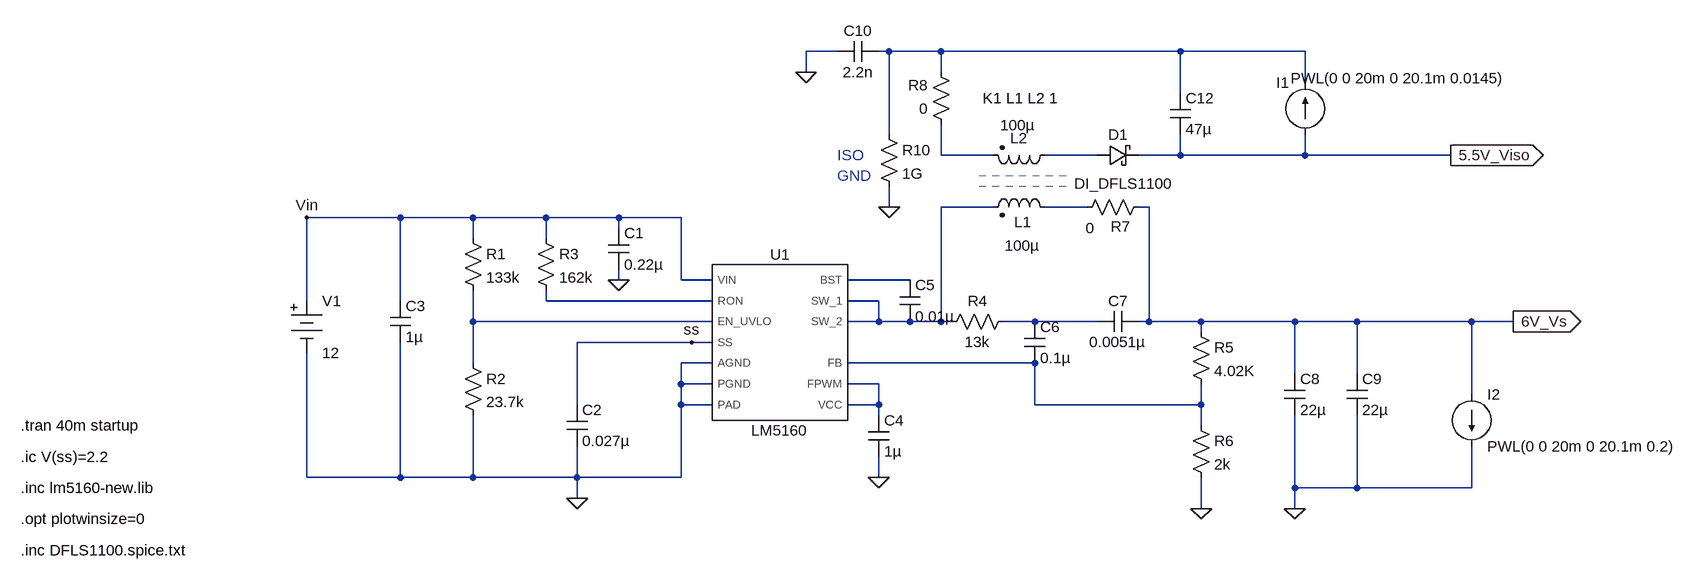
[diagram p0: schematic LM5160_fly-buck.asc]
LM5160_fly-buck.asc, the LTspice schematic file:
Version 4
SHEET 1 1424 680
WIRE 96 -240 48 -240
WIRE 176 -240 160 -240
WIRE 256 -240 176 -240
WIRE 624 -240 256 -240
WIRE 816 -240 624 -240
WIRE 48 -208 48 -240
WIRE 256 -208 256 -240
WIRE 816 -192 816 -240
WIRE 624 -176 624 -240
WIRE 176 -112 176 -240
WIRE 256 -80 256 -128
WIRE 336 -80 256 -80
WIRE 496 -80 416 -80
WIRE 624 -80 624 -112
WIRE 624 -80 560 -80
WIRE 816 -80 816 -112
WIRE 816 -80 624 -80
WIRE 1040 -80 816 -80
WIRE 176 0 176 -32
WIRE 336 0 256 0
WIRE 480 0 416 0
WIRE 576 0 560 0
WIRE -576 16 -720 16
WIRE -464 16 -576 16
WIRE -352 16 -464 16
WIRE -240 16 -352 16
WIRE -144 16 -240 16
WIRE -240 32 -240 16
WIRE -464 48 -464 16
WIRE -352 48 -352 16
WIRE -240 112 -240 96
WIRE -144 112 -144 16
WIRE -96 112 -144 112
WIRE 208 112 112 112
WIRE -720 144 -720 16
WIRE -576 144 -576 16
WIRE -352 144 -352 128
WIRE -96 144 -352 144
WIRE 160 144 112 144
WIRE -464 176 -464 128
WIRE -96 176 -464 176
WIRE 160 176 160 144
WIRE 160 176 112 176
WIRE 208 176 160 176
WIRE 256 176 256 0
WIRE 256 176 208 176
WIRE 272 176 256 176
WIRE 400 176 352 176
WIRE 496 176 400 176
WIRE 576 176 576 0
WIRE 576 176 560 176
WIRE 656 176 576 176
WIRE 800 176 656 176
WIRE 896 176 800 176
WIRE 1072 176 896 176
WIRE 1136 176 1072 176
WIRE 656 192 656 176
WIRE -128 208 -304 208
WIRE -96 208 -128 208
WIRE -464 240 -464 176
WIRE -96 240 -144 240
WIRE 400 240 112 240
WIRE 800 256 800 176
WIRE 896 256 896 176
WIRE -144 272 -144 240
WIRE -96 272 -144 272
WIRE 160 272 112 272
WIRE 1072 288 1072 176
WIRE -304 304 -304 208
WIRE -144 304 -144 272
WIRE -96 304 -144 304
WIRE 160 304 160 272
WIRE 160 304 112 304
WIRE 400 304 400 240
WIRE 656 304 656 272
WIRE 656 304 400 304
WIRE 160 320 160 304
WIRE 656 336 656 304
WIRE -720 416 -720 224
WIRE -576 416 -576 208
WIRE -576 416 -720 416
WIRE -464 416 -464 320
WIRE -464 416 -576 416
WIRE -304 416 -304 368
WIRE -304 416 -464 416
WIRE -144 416 -144 304
WIRE -144 416 -304 416
WIRE 160 416 160 384
WIRE 800 432 800 320
WIRE 896 432 896 320
WIRE 896 432 800 432
WIRE 1072 432 1072 368
WIRE 1072 432 896 432
WIRE -304 448 -304 416
WIRE 656 464 656 416
WIRE 800 464 800 432
FLAG 160 416 0
FLAG 800 464 0
FLAG 656 464 0
FLAG 48 -208 0
FLAG 1040 -80 5.5V_Viso
IOPIN 1040 -80 Out
FLAG 1136 176 6V_Vs
IOPIN 1136 176 Out
FLAG 176 0 0
FLAG -240 112 0
FLAG -128 208 ss
FLAG -304 448 0
FLAG -720 16 Vin
SYMBOL cap 144 320 R0
SYMATTR InstName C4
SYMATTR Value 1µ
SYMATTR SpiceLine V=16 Irms=0 Rser=0.007 Lser=0 mfg="TDK" pn="C3216X7RIC105K" type="X7R"
SYMBOL cap 192 112 R0
SYMATTR InstName C5
SYMATTR Value 0.01µ
SYMATTR SpiceLine V=16 Irms=272m Rser=0.391699 Lser=0 mfg="KEMET" pn="C0805C103K4RAC" type="X7R"
SYMBOL cap 384 176 R0
SYMATTR InstName C6
SYMATTR Value 0.1µ
SYMATTR SpiceLine V=16 Irms=0 Rser=0 Lser=0 mfg="Murata" pn="GCM155R71C104KA55" type="X7R"
SYMBOL res 368 160 R90
WINDOW 0 0 56 VBottom 2
WINDOW 3 32 56 VTop 2
SYMATTR InstName R4
SYMATTR Value 13k
SYMBOL ind2 432 16 M270
WINDOW 0 -22 50 VTop 2
WINDOW 3 -27 51 VBottom 2
SYMATTR InstName L1
SYMATTR Value 100µ
SYMATTR Type ind
SYMATTR SpiceLine Rser=113m
SYMBOL ind2 432 -96 R90
WINDOW 0 5 56 VBottom 2
WINDOW 3 -46 58 VTop 2
SYMATTR InstName L2
SYMATTR Value 100µ
SYMATTR Type ind
SYMATTR SpiceLine Rser=113m
SYMBOL res 576 -16 R90
WINDOW 0 61 44 VBottom 2
WINDOW 3 32 91 VTop 2
SYMATTR InstName R7
SYMATTR Value 0
SYMBOL res 272 -112 R180
WINDOW 0 36 76 Left 2
WINDOW 3 36 40 Left 2
SYMATTR InstName R8
SYMATTR Value 0
SYMBOL cap 160 -256 R90
WINDOW 0 0 32 VBottom 2
WINDOW 3 32 32 VTop 2
SYMATTR InstName C10
SYMATTR Value 2.2n
SYMBOL schottky 496 -64 R270
WINDOW 0 32 32 VTop 2
WINDOW 3 -12 41 VBottom 2
SYMATTR InstName D1
SYMATTR Value DI_DFLS1100
SYMBOL LM5160 0 208 R0
SYMATTR InstName U1
SYMBOL res 160 -128 R0
SYMATTR InstName R10
SYMATTR Value 1G
SYMBOL cap -256 32 R0
SYMATTR InstName C1
SYMATTR Value 0.22µ
SYMATTR SpiceLine V=100 Irms=0 Rser=0 Lser=0 mfg="Murata" pn="GCM31MR72A224KA37" type="X7R"
SYMBOL cap -320 304 R0
SYMATTR InstName C2
SYMATTR Value 0.027µ
SYMATTR SpiceLine V=100 Irms=0 Rser=0 Lser=0 mfg="Murata" pn="GCM21BR72A273KA37" type="X7R"
SYMBOL cap -592 144 R0
SYMATTR InstName C3
SYMATTR Value 1µ
SYMATTR SpiceLine V=100 Irms=0 Rser=0.0053 Lser=651p mfg="Würth Elektronik" pn="885012209069 WCAP-CSGP 1210" type="X7R"
SYMBOL res -480 32 R0
SYMATTR InstName R1
SYMATTR Value 133k
SYMBOL res -480 224 R0
SYMATTR InstName R2
SYMATTR Value 23.7k
SYMBOL Misc\\battery -720 128 R0
WINDOW 123 0 0 Left 0
WINDOW 39 0 0 Left 0
SYMATTR InstName V1
SYMATTR Value 12
SYMBOL res -368 32 R0
SYMATTR InstName R3
SYMATTR Value 162k
SYMBOL cap 560 160 R90
WINDOW 0 0 32 VBottom 2
WINDOW 3 32 32 VTop 2
SYMATTR InstName C7
SYMATTR Value 0.0051µ
SYMATTR SpiceLine V=50 Irms=0 Rser=0 Lser=0 mfg="Murata" pn="GCM1885C1H512JA16" type="C0G"
SYMBOL res 640 176 R0
SYMATTR InstName R5
SYMATTR Value 4.02K
SYMATTR SpiceLine tol=1 pwr=0.1
SYMBOL res 640 320 R0
SYMATTR InstName R6
SYMATTR Value 2k
SYMBOL cap 608 -176 R0
SYMATTR InstName C12
SYMATTR Value 47µ
SYMATTR SpiceLine V=16 Irms=0 Rser=0 Lser=0 mfg="Murata" pn="GRM31CR61C476ME44" type="X5R"
SYMBOL current 816 -112 R180
WINDOW 0 24 80 Left 2
WINDOW 3 -309 87 Left 2
WINDOW 123 0 0 Left 0
WINDOW 39 0 0 Left 0
SYMATTR InstName I1
SYMATTR Value PWL(0 0 20m 0 20.1m 0.0145)
SYMBOL current 1072 288 R0
WINDOW 123 0 0 Left 0
WINDOW 39 0 0 Left 0
SYMATTR InstName I2
SYMATTR Value PWL(0 0 20m 0 20.1m 0.2)
SYMBOL cap 784 256 R0
SYMATTR InstName C8
SYMATTR Value 22µ
SYMATTR SpiceLine V=16 Irms=0 Rser=0.004 Lser=0 mfg="Murata" pn="GRM31CZ71C226ME15" type="X7R"
SYMBOL cap 880 256 R0
SYMATTR InstName C9
SYMATTR Value 22µ
SYMATTR SpiceLine V=16 Irms=0 Rser=0.004 Lser=0 mfg="Murata" pn="GRM31CZ71C226ME15" type="X7R"
TEXT 320 -168 Left 2 !K1 L1 L2 1
TEXT -1160 336 Left 2 !.tran 40m startup
TEXT -1160 384 Left 2 !.ic V(ss)=2.2
TEXT -1160 432 Left 2 !.inc lm5160-new.lib
TEXT -1160 528 Left 2 !.inc DFLS1100.spice.txt
TEXT 96 -80 Left 2 ;ISO\nGND
TEXT -1160 480 Left 2 !.opt plotwinsize=0
LINE Normal 448 -48 304 -48 2
LINE Normal 448 -32 304 -32 2

The netlist it stands for:
* LM5160_fly-buck.asc
C4 N011 0 1µ V=16 Irms=0 Rser=0.007 Lser=0 mfg="TDK" pn="C3216X7RIC105K" type="X7R"
C5 N006 N004 0.01µ V=16 Irms=272m Rser=0.391699 Lser=0 mfg="KEMET" pn="C0805C103K4RAC" type="X7R"
C6 N009 N010 0.1µ V=16 Irms=0 Rser=0 Lser=0 mfg="Murata" pn="GCM155R71C104KA55" type="X7R"
R4 N009 N004 13k
L1 N005 N004 100µ Rser=113m
L2 N003 N002 100µ Rser=113m
R7 6V_Vs N005 0
R8 N002 N001 0
C10 N001 0 2.2n
D1 N003 5.5V_Viso DI_DFLS1100
XU1 0 0 Vin N008 N007 ss N011 N010 N011 N006 N004 N004 0 LM5160  ; pins AGND PGND VIN EN_UVLO RON SS FPWM FB VCC BST SW_1 SW_2 PAD
R10 N001 0 1G
C1 Vin 0 0.22µ V=100 Irms=0 Rser=0 Lser=0 mfg="Murata" pn="GCM31MR72A224KA37" type="X7R"
C2 ss 0 0.027µ V=100 Irms=0 Rser=0 Lser=0 mfg="Murata" pn="GCM21BR72A273KA37" type="X7R"
C3 Vin 0 1µ V=100 Irms=0 Rser=0.0053 Lser=651p mfg="Würth Elektronik" pn="885012209069 WCAP-CSGP 1210" type="X7R"
R1 Vin N008 133k
R2 N008 0 23.7k
V1 Vin 0 12
R3 Vin N007 162k
C7 6V_Vs N009 0.0051µ V=50 Irms=0 Rser=0 Lser=0 mfg="Murata" pn="GCM1885C1H512JA16" type="C0G"
R5 6V_Vs N010 4.02K tol=1 pwr=0.1
R6 N010 0 2k
C12 N001 5.5V_Viso 47µ V=16 Irms=0 Rser=0 Lser=0 mfg="Murata" pn="GRM31CR61C476ME44" type="X5R"
I1 5.5V_Viso N001 PWL(0 0 20m 0 20.1m 0.0145)
I2 6V_Vs 0 PWL(0 0 20m 0 20.1m 0.2)
C8 6V_Vs 0 22µ V=16 Irms=0 Rser=0.004 Lser=0 mfg="Murata" pn="GRM31CZ71C226ME15" type="X7R"
C9 6V_Vs 0 22µ V=16 Irms=0 Rser=0.004 Lser=0 mfg="Murata" pn="GRM31CZ71C226ME15" type="X7R"
.model D D
.lib standard.dio
K1 L1 L2 1
.tran 40m startup
.ic V(ss)=2.2
.inc lm5160-new.lib
.inc DFLS1100.spice.txt
* ISO
* GND
.opt plotwinsize=0
.backanno
.end